# EasyEDA schematic 1-Schematic_Krasnodar-48.json
TITLE: Краснодар-48; REV: 1.0; Date: 2020-10-12; Sheet: 1/1; Drawn By: Romych; Company: zx-pk.ru
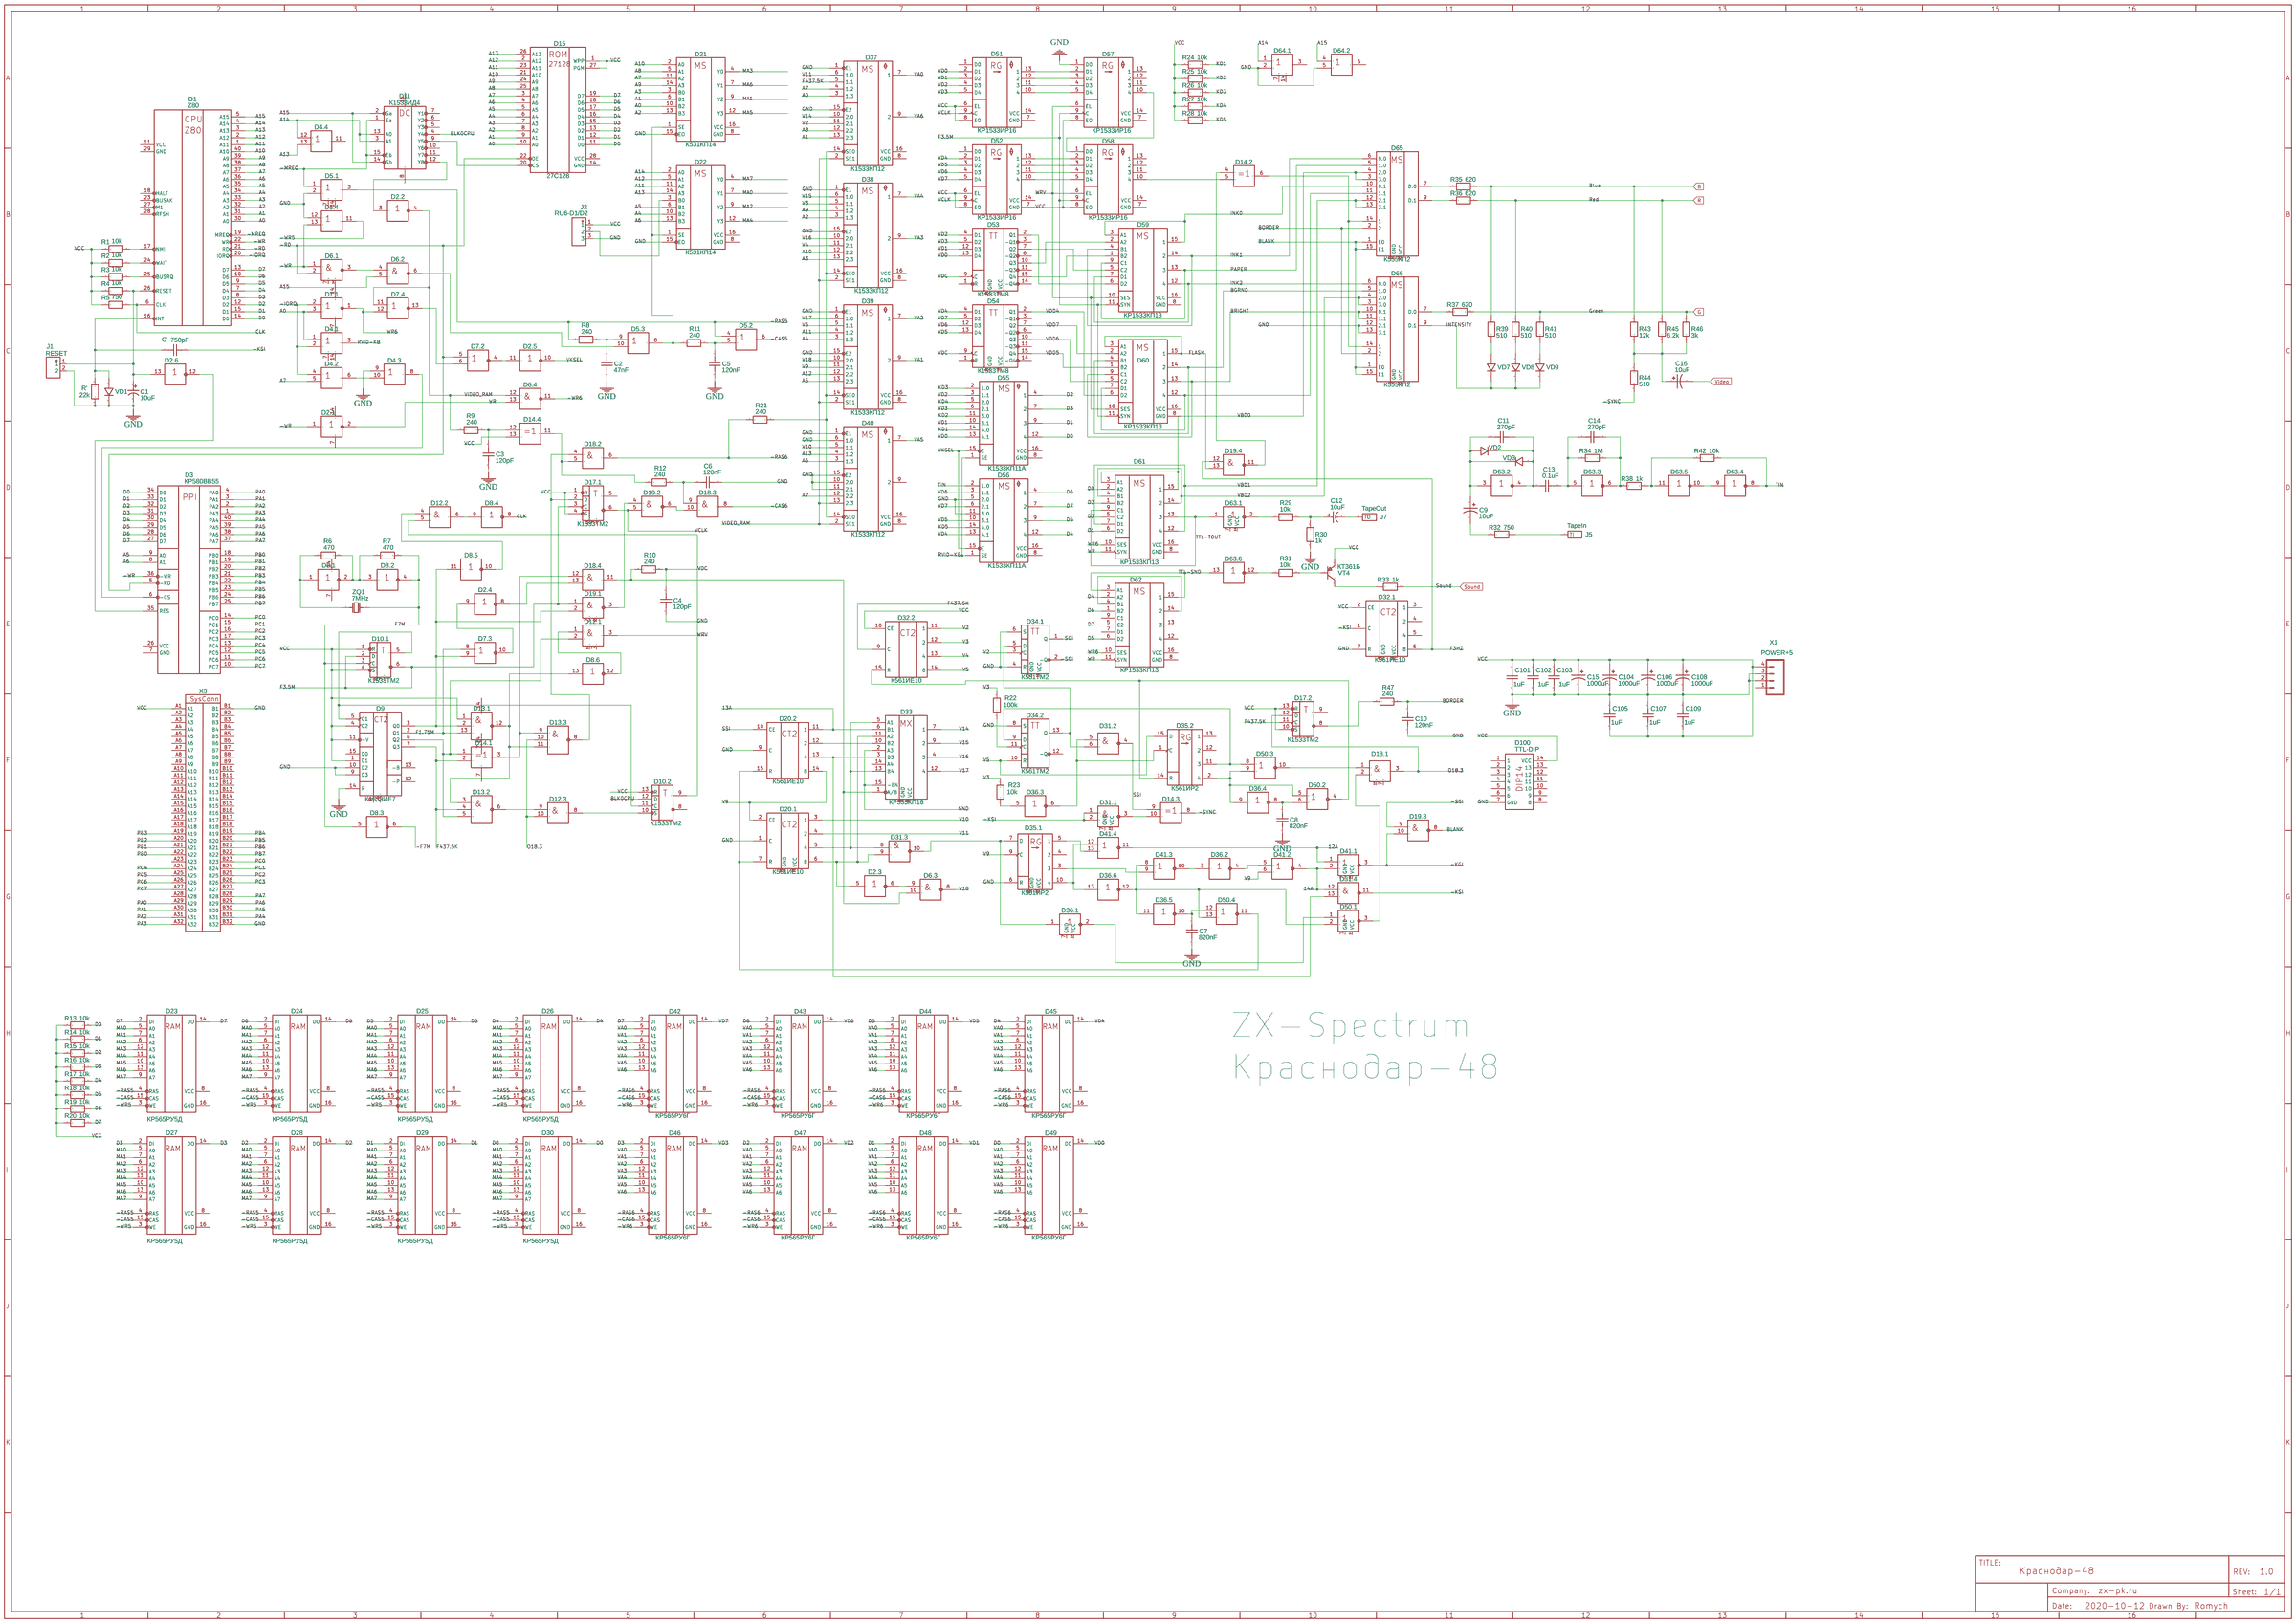
[diagram p0: schematic sheet]

## Parts
C1  10uF  [CAP-TH_BD6.3-P6.00-D0.8-FD]
C2  47nF  [CAP_TH_5.08]
C3  120pF  [CAP_TH_3.68]
C4  120pF  [CAP_TH_2.54]
C5  120nF  [CAP_TH_5.08]
C6  120nF  [CAP_TH_2.54]
C7  820nF  [CAP_TH_5.08]
C8  820nF  [CAP_TH_5.08]
C9  10uF  [CAP-TH_BD5.0-P2.00-D0.8-FD]
C10  120nF  [CAP_TH_5.08]
C11  270pF  [CAP_TH_2.54]
C12  10uF  [CAP-TH_BD5.0-P2.00-D0.8-FD]
C13  0.1uF  [CAP_TH_2.54]
C14  270pF  [CAP_TH_2.54]
C15  1000uF  [CAP-TH_BD6.3-P2.50-D1.0-FD]
C16  10uF  [CAP-TH_BD5.0-P2.00-D0.8-FD]
C101  1uF  [CAP_TH_10.16]
C102  1uF  [CAP_TH_10.16]
C103  1uF  [CAP_TH_3.68]
C104  1000uF  [CAP-TH_BD6.3-P2.50-D1.0-FD]
C105  1uF  [CAP_TH_5.08]
C106  1000uF  [CAP-TH_BD6.3-P2.50-D1.0-FD]
C107  1uF  [CAP_TH_5.08]
C108  1000uF  [CAP-TH_BD6.3-P2.50-D1.0-FD]
C109  1uF  [CAP_TH_5.08]
C'  750pF  [CAP-TH_L7.0-W3.0-P5.00-D0.9]
D1  Z80  [DIP-40_L50.8-W17.8-P2.54-LS15.2-BL]
D2  К1533ЛН1  [DIP-14_L20.0-W7.6-P2.54-LS8.0-BL]  (sections 1,2,3,4,5,6)
D3  КР580ВВ55  [DIP-40_L50.8-W17.8-P2.54-LS15.2-BL]
D4  К1533ЛЛ1  [DIP-14_L20.0-W7.6-P2.54-LS8.0-BL]  (sections 1,2,3,4)
D5  К1533ЛЛ1  [DIP-14_L20.0-W7.6-P2.54-LS8.0-BL]  (sections 1,2,3,4)
D6  К1533ЛА3  [DIP-14_L20.0-W7.6-P2.54-LS8.0-BL]  (sections 1,2,3,4)
D7  К1533ЛЕ1  [DIP-14_L20.0-W7.6-P2.54-LS8.0-BL]  (sections 1,2,3,4)
D8  К1533ЛН1  [DIP-14_L20.0-W7.6-P2.54-LS8.0-BL]  (sections 1,2,3,4,5,6)
D9  К1533ИЕ7  [DIP-16_L19.8-W6.5-P2.54-LS7.6-BL]
D10  К1533ТМ2  [DIP-14_L20.0-W7.6-P2.54-LS8.0-BL]  (sections 1,2)
D11  К1533ИД4  [DIP-16_L20.4-W5.8-P2.54-LS7.6-BL]
D12  К1533ЛИ1  [DIP-14_L20.0-W7.6-P2.54-LS8.0-BL]  (sections 1,2,3)
D13  К1533ЛА4  [DIP-14_L20.0-W7.6-P2.54-LS8.0-BL]  (sections 1,2,3)
D14  К1533ЛП5  [DIP-14_L20.0-W7.6-P2.54-LS8.0-BL]  (sections 1,2,3,4)
D15  27C128  [DIP-28_L35.6-W17.8-P2.54-LS15.2-BL]
D17  К1533ТМ2  [DIP-14_L20.0-W7.6-P2.54-LS8.0-BL]  (sections 1,2)
D18  К1533ЛИ1  [DIP-14_L20.0-W7.6-P2.54-LS8.0-BL]  (sections 1,2,3,4)
D19  К1533ЛА3  [DIP-14_L20.0-W7.6-P2.54-LS8.0-BL]  (sections 1,2,3,4)
D20  К561ИЕ10  [DIP-16_L19.8-W6.5-P2.54-LS7.6-BL]  (sections 1,2)
D21  К531КП14  [DIP-16_L20.4-W5.8-P2.54-LS7.6-BL]
D22  К531КП14  [DIP-16_L20.4-W5.8-P2.54-LS7.6-BL]
D23  КР565РУ5Д  [DIP-16_L19.8-W6.5-P2.54-LS7.6-BL]
D24  КР565РУ5Д  [DIP-16_L19.8-W6.5-P2.54-LS7.6-BL]
D25  КР565РУ5Д  [DIP-16_L19.8-W6.5-P2.54-LS7.6-BL]
D26  КР565РУ5Д  [DIP-16_L19.8-W6.5-P2.54-LS7.6-BL]
D27  КР565РУ5Д  [DIP-16_L19.8-W6.5-P2.54-LS7.6-BL]
D28  КР565РУ5Д  [DIP-16_L19.8-W6.5-P2.54-LS7.6-BL]
D29  КР565РУ5Д  [DIP-16_L19.8-W6.5-P2.54-LS7.6-BL]
D30  КР565РУ5Д  [DIP-16_L19.8-W6.5-P2.54-LS7.6-BL]
D31  К561ЛА7  [DIP-14_L20.0-W7.6-P2.54-LS8.0-BL]  (sections 1,2,3,4)
D32  К561ИЕ10  [DIP-16_L19.8-W6.5-P2.54-LS7.6-BL]  (sections 1,2)
D33  КР555КП16  [DIP-16_L19.8-W6.5-P2.54-LS7.6-BL]
D34  К561ТМ2  [DIP-14_L20.0-W7.6-P2.54-LS8.0-BL]  (sections 1,2)
D35  К561ИР2  [DIP-16_L19.8-W6.5-P2.54-LS7.6-BL]  (sections 1,2)
D36  К561ЛН2  [DIP-14_L20.0-W7.6-P2.54-LS8.0-BL]  (sections 1,2,3,4,5,6)
D37  К1533КП12  [DIP-16_L19.8-W6.5-P2.54-LS7.6-BL]
D38  К1533КП12  [DIP-16_L19.8-W6.5-P2.54-LS7.6-BL]
D39  К1533КП12  [DIP-16_L19.8-W6.5-P2.54-LS7.6-BL]
D40  К1533КП12  [DIP-16_L19.8-W6.5-P2.54-LS7.6-BL]
D41  К561ЛЕ5  [DIP-14_L20.0-W7.6-P2.54-LS8.0-BL]  (sections 1,2,3,4)
D42  КР565РУ6Г  [DIP-16_L19.8-W6.5-P2.54-LS7.6-BL]
D43  КР565РУ6Г  [DIP-16_L19.8-W6.5-P2.54-LS7.6-BL]
D44  КР565РУ6Г  [DIP-16_L19.8-W6.5-P2.54-LS7.6-BL]
D45  КР565РУ6Г  [DIP-16_L19.8-W6.5-P2.54-LS7.6-BL]
D46  КР565РУ6Г  [DIP-16_L19.8-W6.5-P2.54-LS7.6-BL]
D47  КР565РУ6Г  [DIP-16_L19.8-W6.5-P2.54-LS7.6-BL]
D48  КР565РУ6Г  [DIP-16_L19.8-W6.5-P2.54-LS7.6-BL]
D49  КР565РУ6Г  [DIP-16_L19.8-W6.5-P2.54-LS7.6-BL]
D50  К561ЛЕ5  [DIP-14_L20.0-W7.6-P2.54-LS8.0-BL]  (sections 1,2,3,4)
D51  КР1533ИР16  [DIP-14_L20.0-W7.6-P2.54-LS8.0-BL]
D52  КР1533ИР16  [DIP-14_L20.0-W7.6-P2.54-LS8.0-BL]
D53  К1533ТМ8  [DIP-16_L19.8-W6.5-P2.54-LS7.6-BL]
D54  К1533ТМ8  [DIP-16_L19.8-W6.5-P2.54-LS7.6-BL]
D55  К1533КП11A  [DIP-16_L19.8-W6.5-P2.54-LS7.6-BL]
D56  К1533КП11A  [DIP-16_L19.8-W6.5-P2.54-LS7.6-BL]
D57  КР1533ИР16  [DIP-14_L20.0-W7.6-P2.54-LS8.0-BL]
D58  КР1533ИР16  [DIP-14_L20.0-W7.6-P2.54-LS8.0-BL]
D59  КР1533КП13  [DIP-16_L19.8-W6.5-P2.54-LS7.6-BL]
D60  КР1533КП13  [DIP-16_L19.8-W6.5-P2.54-LS7.6-BL]
D61  КР1533КП13  [DIP-16_L19.8-W6.5-P2.54-LS7.6-BL]
D62  КР1533КП13  [DIP-16_L19.8-W6.5-P2.54-LS7.6-BL]
D63  К561ЛН2  [DIP-14_L20.0-W7.6-P2.54-LS8.0-BL]  (sections 1,2,3,4,5,6)
D64  К1533ЛЛ1  [DIP-14_L20.0-W7.6-P2.54-LS8.0-BL]  (sections 1,2)
D65  К555КП2  [DIP-16_L19.8-W6.5-P2.54-LS7.6-BL]
D66  К555КП2  [DIP-16_L19.8-W6.5-P2.54-LS7.6-BL]
D100  TTL-DIP  [DIP-14_L20.0-W7.6-P2.54-LS8.0-BL]
J1  RESET  [HDR-TH_2P-P2.54-V-M]
J2  RU6-D1/D2  [HDR-TH_3P-P2.54-V-M]
J5  TapeIn  [HDR-M-2.54_1X1]
J7  TapeOut  [HDR-M-2.54_1X1]
R1  10k  [R_0.125_7.62]
R2  10k  [R_0.125_7.62]
R3  10k  [R_0.125_7.62]
R4  10k  [R_0.125_7.62]
R5  750  [R_0.125_7.62]
R6  470  [R_0.125_5.08]
R7  470  [R_0.125_5.08]
R8  240  [R_0.125_5.08]
R9  240  [R_0.125_5.08]
R10  240  [R_0.125_V_TH]
R11  240  [R_0.125_5.08]
R12  240  [R_0.125_5.08]
R13  10k  [R_0.125_V_TH]
R14  10k  [R_0.125_V_TH]
R15  10k  [R_0.125_V_TH]
R16  10k  [R_0.125_V_TH]
R17  10k  [R_0.125_V_TH]
R18  10k  [R_0.125_V_TH]
R19  10k  [R_0.125_V_TH]
R20  10k  [R_0.125_V_TH]
R21  240  [R_0.125_V_TH]
R22  100k  [R_0.125_5.08]
R23  10k  [R_0.125_5.08]
R24  10k  [R_0.125_V_TH]
R25  10k  [R_0.125_V_TH]
R26  10k  [R_0.125_V_TH]
R27  10k  [R_0.125_V_TH]
R28  10k  [R_0.125_V_TH]
R29  10k  [R_0.125_V_TH]
R30  1k  [R_0.125_V_TH]
R31  10k  [R_0.125_V_TH]
R32  750  [R_0.125_V_TH]
R33  1k  [R_0.125_V_TH]
R34  1M  [R_0.125_V_TH]
R35  620  [R_0.125_V_TH]
R36  620  [R_0.125_V_TH]
R37  620  [R_0.125_V_TH]
R38  1k  [R_0.125_V_TH]
R39  510  [R_0.125_V_TH]
R40  510  [R_0.125_V_TH]
R41  510  [R_0.125_V_TH]
R42  10k  [R_0.125_V_TH]
R43  12k  [R_0.125_V_TH]
R44  510  [R_0.125_V_TH]
R45  6.2k  [R_0.125_V_TH]
R46  3k  [R_0.125_V_TH]
R47  240  [R_0.125_5.08]
R'  22k  [R_0.125_7.62]
VD1  1N4148  [D_TH_5.08]
VD2  1N4148  [D_TH_2.54_V]
VD3  1N4148  [D_TH_2.54_V]
VD7  1N4148  [D_TH_2.54_V]
VD8  1N4148  [D_TH_2.54_V]
VD9  1N4148  [D_TH_2.54_V]
VT4  КТ361Б  [TO-92-3_L4.8-W3.7-P2.54-L]
X1  POWER+5  [MOLEX-1X4]
X3  SysExt  [SYS_CONN_32X2_5.08]
ZQ1  7MHz  [OSC-49U-1]

## Library data of the parts
C1 C12 = ECLJ0612220M101P00: Supplier: LCSC; Supplier Part: C156809; Manufacturer: Guangdong TOPAZ Elec Tech; Contributor: LCSC
C2-C8 C10 C11 C13 C14 C101-C103 C105 C107 C109 C' = CK45-R3AD152K-VRY: Supplier: LCSC; Supplier Part: C340608; Manufacturer: TDK; Contributor: LCSC
C9 C16 = 25MH710MEFCT55X7: Supplier: LCSC; Supplier Part: C473156; Manufacturer: Rubycon; Contributor: LCSC
C15 C104 C106 C108 = SHW1000UF6.3V6.3X11: Supplier: LCSC; Supplier Part: C494544; Manufacturer: KNSCHA; Contributor: LCSC
D1 = Z80: Supplier: chipdip; Contributor: Roman Boykov
D2 D8 = К1533ЛН1: Supplier: chipdip; Contributor: Roman Boykov; subpart_no: 7
D3 = КР580ВВ55: Supplier: chipdip; Contributor: romychs_4693
D4 D5 D64 = К1533ЛЛ1: Supplier: chipdip; Contributor: Roman Boykov; subpart_no: 1
D6 D19 = К1533ЛА3: Supplier: chipdip; Contributor: Roman Boykov; subpart_no: 1
D7 = К1533ЛЕ1: Supplier: chipdip; Contributor: Roman Boykov; subpart_no: 1
D9 = К1533ИЕ7: Contributor: romychs_4693
D10 D17 = К1533ТМ2: Supplier: chipdip; Contributor: romychs_4693; subpart_no: 3
D11 = К1533ИД4: Supplier: chipdip; Contributor: romychs_4693
D12 D18 = К1533ЛИ1: Supplier: chipdip; Contributor: Roman Boykov; subpart_no: 1
D13 = К1533ЛА4: Supplier: chipdip; Contributor: Roman Boykov; subpart_no: 1
D14 = К1533ЛП5: Supplier: chipdip; Contributor: Roman Boykov; subpart_no: 4
D15 = 27C128: Supplier: chipdip; Contributor: romychs_4693
D20 D32 = К561ИЕ10: Supplier: chipdip; Contributor: romychs_4693; subpart_no: 2
D21 D22 = К531КП14: Supplier: chipdip; Contributor: romychs_4693
D23-D30 = КР565РУ5Г: Supplier: chipdip; Contributor: romychs_4693
D31 = К561ЛА7: Supplier: chipdip; Contributor: romychs_4693; subpart_no: 3
D33 = КР555КП16: Supplier: chipdip; Contributor: romychs_4693
D34 = К561ТМ2: Supplier: chipdip; Contributor: Roman Boykov; subpart_no: 1
D35 = К561ИР2: Supplier: chipdip; Contributor: Roman Boykov; subpart_no: 1
D36 D63 = К561ЛН2: Supplier: chipdip; Contributor: romychs_4693; subpart_no: 1
D37-D40 = К1533КП12: Supplier: chipdip; Contributor: romychs_4693
D41 D50 = К561ЛЕ5: Supplier: chipdip; Contributor: romychs_4693; subpart_no: 1
D42-D49 = КР565РУ6Г: Supplier: chipdip; Contributor: Roman Boykov
D51 D52 D57 D58 = КР1533ИР16: Supplier: chipdip; Contributor: romychs_4693
D53 D54 = К1533ТМ8: Supplier: chipdip; Contributor: Roman Boykov
D55 D56 = К1533КП11A: Supplier: chipdip; Contributor: Roman Boykov
D59-D62 = КР1533КП13: Supplier: chipdip; Contributor: romychs_4693
D65 D66 = К555КП2: Supplier: chipdip; Contributor: Roman Boykov
D100 = TTL-DIP: Contributor: romychs_4693
J1 = 22102021: Supplier: LCSC; Supplier Part: C587007; Manufacturer: MOLEX; Contributor: LCSC
J2 = A2541WV-3P_C609572: Supplier: LCSC; Supplier Part: C609572; Manufacturer: CJT(Changjiang Connectors); Manufacturer Part: A2541WV-3P; Contributor: LCSC
J5 J7 = HDR-M-2.54_1x1: Supplier Part: C81276; Supplier: LCSC; Contributor: LCEDA_Lib
R1-R47 R' = RN 1/8W 470R F T/B A1: Supplier: LCSC; Supplier Part: C433478; Manufacturer: TyoHM; Contributor: LCSC
VD1-VD3 VD7-VD9 = 1N4148: Contributor: EasyEDA
VT4 = 2SA1015-TA: Supplier: LCSC; Supplier Part: C160132; Manufacturer: Changjiang Electronics Tech (CJ); Contributor: LCSC
X1 = M04POLAR: Header 4; Contributor: SparkFun
X3 = SysConn-32x2: Supplier: chipdip; Contributor: romychs_4693
ZQ1 = X49UD12MSD2SC: Supplier: LCSC; Manufacturer: YXC; Supplier Part: C2188

## Nets
GND: C1.2 C2.2 C3.2 C4.2 C5.2 C6.2 C7.1 C8.1 C10.2 C15.2 C101.2 C102.2 C103.2 C104.2 C105.1 C106.2 C107.1 C108.2 C109.1 D4.9(1) D5.2 D5.12(1) D9.9(D3) D9.10(D2) D9.14(R) D20.1(C) D20.9(C) D21.15(EO) D22.15(EO) D32.7(R) D33.2(A3) D33.15(-EN) D34.4(R) D34.6(S) D34.8(S) D35.6(R) D37.1(E1) D37.15(E2) D38.1(E1) D38.15(E2) D39.1(E1) D39.15(E2) D40.1(E1) D40.6(1.0) D40.10(2.0) D40.11(2.1) D40.15(E2) D56.5(2.0) D56.11(3.0) D57.1(D0) D64.2 D64.5(2) D66.12(2.1) D66.13(3.1) D100.7(GND) J1.2 J2.3 R30.2 R'.2 VD1.2(K) X1.2 X1.3 X3.B1 X3.B32
V2: D32.11(1) D34.3(C) D37.11(2.1)
V3: D32.12(2) D38.5(1.1) R22.2 R23.2
V4: D32.13(4) D38.11(2.1)
V5: D32.14(8) D34.10(R) D35.15(D) D39.5(1.1)
V9: D20.2(CE) D20.14(8) D35.9(C) D39.11(2.1) D41.6(I2)
V10: D20.3(1) D40.5(1.1)
V11: D20.4(2) D37.6(1.0)
V14: D33.7(1) D37.10(2.0)
V15: D33.9(2) D38.6(1.0)
V16: D33.4(3) D38.10(2.0)
V17: D33.12(4) D39.6(1.0)
V18: D6.8(3) D39.10(2.0)
VCC: C15.1 C101.1 C102.1 C103.1 C104.1 C105.2 C106.1 C107.2 C108.1 C109.2 D9.1(D1) D9.4(C2) D9.11(-V) D10.1(R) D10.4(S) D10.13(R) D13.1(I1) D14.13(2) D15.1(WPP) D15.27(PGM) D17.1(R) D17.4(S) D17.10(S) D17.13(R) D32.2(CE) D32.10(CE) D51.6(EL) D51.8(EO) D52.6(EL) D52.7(GND) D52.8(EO) D57.8(EO) D58.8(EO) D100.14(VCC) J2.1 R1.1 R2.1 R3.1 R4.1 R5.1 R13.2 R14.2 R15.2 R16.2 R17.2 R18.2 R19.2 R20.2 R24.2 R25.2 R26.2 R27.2 R28.2 VT4.1(E) X1.4 X3.A1
VDD4: D54.2(Q1) D60.6(D2)
VDD5: D54.15(Q4) D60.1(B2)
VDD6: D54.10(Q3) D60.5(C2)
VDD7: D54.7(Q2) D60.2(A2)
12A: D41.1(I1) D41.11(O)
13A: D20.11(1) D33.6(B1)
14A: D31.12(I1) D41.2(I2) D41.4(O)
-CAS5: D5.6(3) D23.15(CAS) D24.15(CAS) D25.15(CAS) D26.15(CAS) D27.15(CAS) D28.15(CAS) D29.15(CAS) D30.15(CAS)
-CAS6: D18.8(3) D42.15(CAS) D43.15(CAS) D44.15(CAS) D45.15(CAS) D46.15(CAS) D47.15(CAS) D48.15(CAS) D49.15(CAS)
-F7M: D8.6(2)
-IORQ: D1.20(IORQ) D4.2 D4.4(1) D7.2(1)
-KGI: D19.10(2) D41.3(O)
-KSI: C'.1 D31.1(I1) D31.2(I2) D31.11(O) D32.1(C)
-MREQ: D1.19(MREQ) D5.1 D11.1(Ea) D11.15(Eb)
-RAS5: D5.3 D5.4(1) D23.4(RAS) D24.4(RAS) D25.4(RAS) D26.4(RAS) D27.4(RAS) D28.4(RAS) D29.4(RAS) D30.4(RAS) R8.1
-RAS6: D18.6(3) D42.4(RAS) D43.4(RAS) D44.4(RAS) D45.4(RAS) D46.4(RAS) D47.4(RAS) D48.4(RAS) D49.4(RAS) R21.1
-RD: D1.21(RD) D3.5(-RD) D6.2 D7.5(1) D15.22(DE)
-SGI: D19.9(1) D34.2(-Q)
-SYNC: D14.8(3) R44.2
-WR: D1.22(WR) D2.1 D3.36(-WR) D5.13(2) D6.1
-WR5: D5.11(3) D23.3(WE) D24.3(WE) D25.3(WE) D26.3(WE) D27.3(WE) D28.3(WE) D29.3(WE) D30.3(WE)
-WR6: D6.11(3) D42.3(WE) D43.3(WE) D44.3(WE) D45.3(WE) D46.3(WE) D47.3(WE) D48.3(WE) D49.3(WE)
A0: D1.30(A0) D4.1 D7.3(2) D15.10(A0) D21.10(B2) D37.3(1.3)
A1: D1.31(A1) D15.9(A1) D21.6(B1) D37.13(2.3)
A2: D1.32(A2) D15.8(A2) D21.13(B3) D38.3(1.3)
A3: D1.33(A3) D15.7(A3) D21.3(B0) D38.13(2.3)
A4: D1.34(A4) D15.6(A4) D22.10(B2) D39.3(1.3)
A5: D1.35(A5) D3.9(A0) D15.5(A5) D22.6(B1) D39.13(2.3)
A6: D1.36(A6) D3.8(A1) D15.4(A6) D22.13(B3) D40.3(1.3)
A7: D1.37(A7) D4.5(2) D15.3(A7) D21.11(A2) D37.4(1.2) D40.12(2.2)
A8: D1.38(A8) D15.25(A8) D21.5(A1) D37.12(2.2)
A9: D1.39(A9) D15.24(A9) D21.14(A3) D38.4(1.2)
A10: D1.40(A10) D15.21(A10) D21.2(A0) D38.12(2.2)
A11: D1.1(A11) D15.23(A11) D22.11(A2) D39.4(1.2)
A12: D1.2(A12) D15.2(A12) D22.5(A1) D39.12(2.2)
A13: D1.3(A13) D4.13(2) D15.26(A13) D22.14(A3) D40.4(1.2)
A14: D1.4(A14) D4.12(1) D11.3(A1) D11.13(A0) D22.2(A0) D64.1
A15: D1.5(A15) D6.5(2) D11.2(Sa) D11.14(Sb) D64.4(1)
B: R35.1 R39.1 R43.1
BGRND: D60.4(B1) D60.14(2) D66.5(1.0)
BLANK: D19.8(3) D65.1(E0) D65.15(E1) D66.1(E0) D66.15(E1)
BLK0CPU: D10.12(D) D11.4(Y4)
BORDER: C10.1 D65.2 D66.2 R47.2
BRIGHT: D60.9(C1) D60.13(3) D66.10(0.1) D66.11(1.1)
CLK: D1.6(CLK) D8.8(2) R5.2
D0: D1.14(D0) D3.34(D0) D15.11(D0) D30.2(DI) D30.14(DO) D49.2(DI) D55.12(4) D61.2(A2) R13.1
D1: D1.15(D1) D3.33(D1) D15.12(D1) D29.2(DI) D29.14(DO) D48.2(DI) D55.9(3) D61.6(D2) R14.1
D2: D1.12(D2) D3.32(D2) D15.13(D2) D28.2(DI) D28.14(DO) D47.2(DI) D55.4(1) D61.1(B2) R15.1
D3: D1.8(D3) D3.31(D3) D15.15(D3) D27.2(DI) D27.14(DO) D46.2(DI) D55.7(2) D61.5(C2) R16.1
D4: D1.7(D4) D3.30(D4) D15.16(D4) D26.2(DI) D26.14(DO) D45.2(DI) D56.12(4) D62.2(A2) R17.1
D5: D1.9(D5) D3.29(D5) D15.17(D5) D25.2(DI) D25.14(DO) D44.2(DI) D56.9(3) D62.6(D2) R18.1
D6: D1.10(D6) D3.28(D6) D15.18(D6) D24.2(DI) D24.14(DO) D43.2(DI) D56.4(1) D62.1(B2) R19.1
D7: D1.13(D7) D3.27(D7) D15.19(D7) D23.2(DI) D23.14(DO) D42.2(DI) D56.7(2) D62.5(C2) R20.1
F1.75M: D7.8(1) D9.2(Q1) D13.13(I3)
F3.5M: D10.2(D) D10.6(&#126;Q) D17.3(С) D19.1 D57.9(C) D58.9(C) D59.11(SYN) D60.11(SYN)
F3HZ: D19.12(1) D32.6(8)
F7M: D8.4(2) D8.5(1) D10.3(С) R7.2 ZQ1.1(OSC1)
F437.5K: D9.7(Q3) D13.4(I2) D14.2 D17.11(C) D32.9(C) D37.5(1.1)
FLASH: D19.13(2) D60.3(A1) D60.15(1)
G: R37.1 R41.1 R46.1
INK0: D59.3(A1) D59.15(1) D65.10(0.1)
INK1: D59.4(B1) D59.14(2) D65.6(0.0)
INK2: D59.7(D1) D59.12(4) D66.6(0.0)
INTENSITY: D66.9(D.1) VD7.2(K) VD8.2(K) VD9.2(K)
KD1: D55.14(4.0) R24.1
KD2: D55.11(3.0) R25.1
KD3: D55.2(1.0) R26.1
KD4: D55.5(2.0) R27.1
KD5: D56.14(4.0) R28.1
MA0: D22.7(Y1) D23.5(A0) D24.5(A0) D25.5(A0) D26.5(A0) D27.5(A0) D28.5(A0) D29.5(A0) D30.5(A0)
MA1: D21.9(Y2) D23.7(A1) D24.7(A1) D25.7(A1) D26.7(A1) D27.7(A1) D28.7(A1) D29.7(A1) D30.7(A1)
MA2: D22.9(Y2) D23.6(A2) D24.6(A2) D25.6(A2) D26.6(A2) D27.6(A2) D28.6(A2) D29.6(A2) D30.6(A2)
MA3: D21.4(Y0) D23.12(A3) D24.12(A3) D25.12(A3) D26.12(A3) D27.12(A3) D28.12(A3) D29.12(A3) D30.12(A3)
MA4: D22.12(Y3) D23.11(A4) D24.11(A4) D25.11(A4) D26.11(A4) D27.11(A4) D28.11(A4) D29.11(A4) D30.11(A4)
MA5: D21.12(Y3) D23.10(A5) D24.10(A5) D25.10(A5) D26.10(A5) D27.10(A5) D28.10(A5) D29.10(A5) D30.10(A5)
MA6: D21.7(Y1) D23.13(A6) D24.13(A6) D25.13(A6) D26.13(A6) D27.13(A6) D28.13(A6) D29.13(A6) D30.13(A6)
MA7: D22.4(Y0) D23.9(A7) D24.9(A7) D25.9(A7) D26.9(A7) D27.9(A7) D28.9(A7) D29.9(A7) D30.9(A7)
O18.3: D12.10(2) D13.10(I2) D17.12(D) D18.3
PA0: D3.4(PA0) X3.A29
PA1: D3.3(PA1) X3.A30
PA2: D3.2(PA2) X3.A31
PA3: D3.1(PA3) X3.A32
PA4: D3.40(PA4) X3.B31
PA5: D3.39(PA5) X3.B30
PA6: D3.38(PA6) X3.B29
PA7: D3.37(PA7) X3.B28
PAPER: D59.9(C1) D59.13(3) D65.5(1.0)
PB0: D3.18(PB0) X3.A22
PB1: D3.19(PB1) X3.A21
PB2: D3.20(PB2) X3.A20
PB3: D3.21(PB3) X3.A19
PB4: D3.22(PB4) X3.B19
PB5: D3.23(PB5) X3.B20
PB6: D3.24(PB6) X3.B21
PB7: D3.25(PB7) X3.B22
PC0: D3.14(PC0) X3.B23
PC1: D3.15(PC1) X3.B24
PC2: D3.16(PC2) X3.B25
PC3: D3.17(PC3) X3.B26
PC4: D3.13(PC4) X3.A24
PC5: D3.12(PC5) X3.A25
PC6: D3.11(PC6) X3.A26
PC7: D3.10(PC7) X3.A27
R: R36.1 R40.1 R45.1
RVID-KB: D4.3 D55.1(SE) D56.1(SE)
SGI: D34.1(Q)
Sound: R33.1
SSI: D14.9(1) D20.10(CE) D31.4(O)
TIN: D56.2(1.0) D63.8(O) R42.1
TTL-SND: D62.3(A1) D62.15(1) D63.13(I)
TTL-TOUT: D61.9(C1) D61.13(3) D63.1(I)
VA0: D37.7(1) D42.5(A0) D43.5(A0) D44.5(A0) D45.5(A0) D46.5(A0) D47.5(A0) D48.5(A0) D49.5(A0)
VA1: D39.9(2) D42.7(A1) D43.7(A1) D44.7(A1) D45.7(A1) D46.7(A1) D47.7(A1) D48.7(A1) D49.7(A1)
VA2: D39.7(1) D42.6(A2) D43.6(A2) D44.6(A2) D45.6(A2) D46.6(A2) D47.6(A2) D48.6(A2) D49.6(A2)
VA3: D38.9(2) D42.12(A3) D43.12(A3) D44.12(A3) D45.12(A3) D46.12(A3) D47.12(A3) D48.12(A3) D49.12(A3)
VA4: D38.7(1) D42.11(A4) D43.11(A4) D44.11(A4) D45.11(A4) D46.11(A4) D47.11(A4) D48.11(A4) D49.11(A4)
VA5: D40.7(1) D42.10(A5) D43.10(A5) D44.10(A5) D45.10(A5) D46.10(A5) D47.10(A5) D48.10(A5) D49.10(A5)
VA6: D37.9(2) D42.13(A6) D43.13(A6) D44.13(A6) D45.13(A6) D46.13(A6) D47.13(A6) D48.13(A6) D49.13(A6)
VBD0: D61.3(A1) D61.15(1) D65.3(3.0) D65.4(2.0)
VBD1: D61.7(D1) D61.12(4) D65.12(2.1) D65.13(3.1)
VBD2: D61.4(B1) D61.14(2) D66.3(3.0) D66.4(2.0)
VCLK: D17.6(&#126;Q) D19.5(2) D51.9(C) D52.9(C)
VD0: D49.14(DO) D51.2(D1) D53.13(D4) D55.13(4.1)
VD1: D48.14(DO) D51.3(D2) D53.12(D3) D55.10(3.1)
VD2: D47.14(DO) D51.4(D3) D53.4(D1) D55.3(1.1)
VD3: D46.14(DO) D51.5(D4) D53.5(D2) D55.6(2.1)
VD4: D45.14(DO) D52.2(D1) D54.4(D1) D56.13(4.1)
VD5: D44.14(DO) D52.3(D2) D54.13(D4) D56.10(3.1)
VD6: D43.14(DO) D52.4(D3) D54.12(D3) D56.3(1.1)
VD7: D42.14(DO) D52.5(D4) D54.5(D2) D56.6(2.1)
VDC: C4.1 D53.9(C) D54.9(C) R10.2
Video: C16.2
VIDEO_RAM: D2.4(2) D6.12(1) D7.11(1) D37.2(SE1) D38.2(SE1) D39.2(SE1) D40.2(SE1) D40.13(2.3) R9.1
VKSEL: D2.10(2) D55.15(E) D56.15(E)
WR: D2.2 D6.13(2) D61.11(SYN) D62.11(SYN)
WR6: D7.1(3) D7.12(2) D61.10(SES) D62.10(SES)
WRV: D12.3 D57.6(EL) D58.6(EL) D59.10(SES) D60.10(SES)
Net-(C1-1): C1.1 D1.26(RESET) D2.13(1) J1.1 R4.2
Net-(C2-1): C2.1 D5.9(1) R8.2
Net-(C3-1): C3.1 D14.12(1) R9.2
Net-(C5-1): C5.1 D5.5(2) R11.2
Net-(C6-1): C6.1 D18.9(1) R12.2
Net-(C7-2): C7.2 D36.10(O) D50.12(I1)
Net-(C8-2): C8.2 D36.8(O) D50.6(I2)
Net-(C9-1): C9.1 C11.1 D63.3(I) VD2.1(A) VD3.2(K)
Net-(C9-2): C9.2 R32.2
Net-(C11-2): C11.2 C13.1 D63.4(O) VD2.2(K) VD3.1(A)
Net-(C12-1): C12.1 R29.2 R30.1
Net-(C12-2): C12.2 J7.1(TO)
Net-(C13-2): C13.2 C14.1 D63.5(I) R34.2
Net-(C14-2): C14.2 D63.6(O) R34.1 R38.2
Net-(C16-1): C16.1 R43.2 R44.1 R45.2 R46.2
Net-(C'-2): C'.2 D1.16(INT) R'.1 VD1.1(A)
Net-(D1-17): D1.17(NMI) R1.2
Net-(D1-24): D1.24(WAIT) R2.2
Net-(D1-25): D1.25(BUSRQ) R3.2
Net-(D2.2-3): D2.3(1) D11.12(Y8)
Net-(D2.3-5): D2.5(1) D20.6(8) D31.9(I2) D33.11(A2)
Net-(D2.3-6): D2.6(2) D6.9(1)
Net-(D2.4-8): D2.8(2) D18.13(2)
Net-(D2.4-9): D2.9(1) D7.10(3)
Net-(D2.5-11): D2.11(1) D7.4(3)
Net-(D2.6-12): D2.12(2) D3.35(RES)
Net-(D3-6): D3.6(-CS) D4.8(3)
Net-(D4.2-6): D4.6(3) D4.10(2)
Net-(D5.3-8): D5.8(3) D21.1(SE) D22.1(SE) R11.1
Net-(D5.3-10): D5.10(2) D6.6(3)
Net-(D6.1-3): D6.3 D6.4(1)
Net-(D6.1-14): D6.14(VCC) D7.14(VCC)
Net-(D6.3-10): D6.10(2) D18.11(3) D33.1(A/B) R10.1
Net-(D7.2-6): D7.6(2) D7.13(3)
Net-(D7.3-9): D7.9(2) D8.11(1) D9.3(Q0) D13.2(I2) D19.2
Net-(D8.1-1): D8.1 R6.1 ZQ1.2(OSC2)
Net-(D8.1-2): D8.2 D8.3(1) R6.2 R7.1
Net-(D8.4-9): D8.9(1) D12.6(3)
Net-(D8.5-10): D8.10(2) D12.4(1)
Net-(D8.6-12): D8.12(2) D12.1
Net-(D8.6-13): D8.13(1) D13.3(I1) D13.11(I3) D13.12(O)
Net-(D9-5): D9.5(C1) D10.5(Q) D10.11(C)
Net-(D9-6): D9.6(Q2) D12.2 D13.5(I3) D14.1
Net-(D10.2-9): D10.9(Q) D12.5(2)
Net-(D10.2-10): D10.10(S) D12.8(3)
Net-(D11-9): D11.9(Y5) D15.20(CS)
Net-(D12.3-9): D12.9(1) D13.6(O)
Net-(D13.3-8): D13.8(O) D17.2(D) D18.4(1)
Net-(D13.3-9): D13.9(I1) D14.3 D18.12(1)
Net-(D14.2-4): D14.4(1) D19.11(3)
Net-(D14.2-5): D14.5(2) D58.10(4)
Net-(D14.2-6): D14.6(3) D65.14(1) D66.14(1)
Net-(D14.3-10): D14.10(2) D31.3(O)
Net-(D14.4-11): D14.11(3) D18.5(2) R12.1
Net-(D17.2-8): D17.8(-Q) R47.1
Net-(D18.1-1): D18.1 D50.10(O)
Net-(D18.1-2): D18.2 D50.3(O)
Net-(D18.3-10): D18.10(2) D19.6(3)
Net-(D19.1-3): D19.3 D19.4(1)
Net-(D20.1-5): D20.5(4) D31.8(I1) D33.5(A1) D33.13(B4)
Net-(D20.1-7): D20.7(R) D20.15(R) D50.11(O)
Net-(D20.2-12): D20.12(2) D33.10(B2)
Net-(D20.2-13): D20.13(4) D31.13(I2) D33.3(B3)
Net-(D22-3): D22.3(B0) J2.2
Net-(D31.2-5): D31.5(I1) D35.1(C) D36.6(O)
Net-(D31.2-6): D31.6(I2) D34.5(D) D34.13(Q)
Net-(D31.3-10): D31.10(O) D35.7(D) D36.1(I)
Net-(D32.2-15): D32.15(R) D35.14(R) D50.4(O)
Net-(D34.2-9): D34.9(D) D35.11(3) D50.8(I1)
Net-(D34.2-11): D34.11(C) R22.1
Net-(D35.1-3): D35.3 D41.9(I2)
Net-(D35.1-5): D35.5(1) D41.13(I2)
Net-(D35.1-10): D35.10(4) D36.13(I) D41.12(I1)
Net-(D35.2-2): D35.2(4) D36.9(I) D50.5(I1) D50.9(I2)
Net-(D36.1-2): D36.2(O) D50.1(I1)
Net-(D36.2-3): D36.3(I) D41.10(O)
Net-(D36.2-4): D36.4(O) D41.5(I1)
Net-(D36.3-5): D36.5(I) R23.1
Net-(D36.5-11): D36.11(I) D36.12(O) D41.8(I1) D50.2(I2) D50.13(I2)
Net-(D37-14): D37.14(SE0) D38.14(SE0) D39.14(SE0) D40.14(SE0) R21.2
Net-(D51-10): D51.10(4) D57.5(D4)
Net-(D51-11): D51.11(3) D57.4(D3)
Net-(D51-12): D51.12(2) D57.3(D2)
Net-(D51-13): D51.13(1) D57.2(D1)
Net-(D52-10): D52.10(4) D58.5(D4)
Net-(D52-11): D52.11(3) D58.4(D3)
Net-(D52-12): D52.12(2) D58.3(D2)
Net-(D52-13): D52.13(1) D58.2(D1)
Net-(D53-2): D53.2(Q1) D59.6(D2)
Net-(D53-7): D53.7(Q2) D59.5(C2)
Net-(D53-10): D53.10(Q3) D59.2(A2)
Net-(D53-15): D53.15(Q4) D59.1(B2)
Net-(D57-10): D57.10(4) D58.1(D0)
Net-(D60-7): D60.7(D1) D60.12(4) D65.11(1.1)
Net-(D62-4): D62.4(B1) D62.14(2)
Net-(D63.1-2): D63.2(O) R29.1
Net-(D63.4-9): D63.9(I) D63.10(O)
Net-(D63.5-11): D63.11(I) R38.1 R42.2
Net-(D63.6-12): D63.12(O) R31.1
Net-(D65-7): D65.7(D.0) R35.2
Net-(D65-9): D65.9(D.1) R36.2
Net-(D66-7): D66.7(D.0) R37.2
Net-(J5-1): J5.1(TI) R32.1
Net-(R31-2): R31.2 VT4.3(B)
Net-(R33-2): R33.2 VT4.2(C)
Net-(R39-2): R39.2 VD7.1(A)
Net-(R40-2): R40.2 VD8.1(A)
Net-(R41-2): R41.2 VD9.1(A)

Not connected (* = marked no-connect by the designer): D1 11(VCC) 18(HALT) 23(BUSAK) 27(M1) 28(RFSH) 29(GND); D2 7(GND) 14(VCC); D3 7(GND) 26(VCC); D4 7(GND) 11(3) 14(VCC); D5 7(GND) 14(VCC); D6 7(GND); D7 7(GND); D8 7(GND) 14(VCC); D9 8(GND) 12(-P) 13(-B) 15(D0) 16(VCC); D10 7(GND) 8(-Q) 14(VCC); D11 5(Y3) 6(Y2) 7(Y1) 8(GND) 10(Y6) 11(Y7) 16(VCC); D12 7(GND) 14(VCC); D13 7(GND) 14(VCC); D14 7(GND) 14(VCC); D15 14(GND) 28(VCC); D17 5(Q) 7(GND) 9(Q) 14(VCC); D18 7(GND) 14(VCC); D19 7(GND) 14(VCC); D20 8(GND) 16(VCC); D21 8(GND) 16(VCC); D22 8(GND) 16(VCC); D23 8(VCC) 16(GND); D24 8(VCC) 16(GND); D25 8(VCC) 16(GND); D26 8(VCC) 16(GND); D27 8(VCC) 16(GND); D28 8(VCC) 16(GND); D29 8(VCC) 16(GND); D30 8(VCC) 16(GND); D31 7(GND) 14(VCC); D32 3(1) 4(2) 5(4) 8(GND) 16(VCC); D33 8(GND) 14(A4) 16(VCC); D34 7(GND) 12(-Q) 14(VCC); D35 4(2) 8(GND) 12(2) 13(1) 16(VCC); D36 7(GND) 14(VCC); D37 8(GND) 16(VCC); D38 8(GND) 16(VCC); D39 8(GND) 16(VCC); D40 8(GND) 9(2) 16(VCC); D41 7(GND) 14(VCC); D42 8(VCC) 16(GND); D43 8(VCC) 16(GND); D44 8(VCC) 16(GND); D45 8(VCC) 16(GND); D46 8(VCC) 16(GND); D47 8(VCC) 16(GND); D48 8(VCC) 16(GND); D49 8(VCC) 16(GND); D50 7(GND) 14(VCC); D51 1(D0) 7(GND) 14(VCC); D52 1(D0) 14(VCC); D53 1(R) 3(-Q1) 6(-Q2) 8(GND) 11(-Q3) 14(-Q4) 16(VCC); D54 1(R) 3(-Q1) 6(-Q2) 8(GND) 11(-Q3) 14(-Q4) 16(VCC); D55 8(GND) 16(VCC); D56 8(GND) 16(VCC); D57 7(GND) 11(3) 12(2) 13(1) 14(VCC); D58 7(GND) 11(3) 12(2) 13(1) 14(VCC); D59 8(GND) 16(VCC); D60 8(GND) 16(VCC); D61 8(GND) 16(VCC); D62 7(D1) 8(GND) 9(C1) 12(4) 13(3) 16(VCC); D63 7(GND) 14(VCC); D64 3 6(3) 7(GND) 14(VCC); D65 8(GND) 16(VCC); D66 8(GND) 16(VCC); D100 1 2 3 4 5 6 8 9 10 11 12 13; X1 1; X3 A2 A3 A4 A5 A6 A7 A8 A9 A10 A11 A12 A13 A14 A15 A16 A17 A18 A23 A28 B2 B3 B4 B5 B6 B7 B8 B9 B10 B11 B12 B13 B14 B15 B16 B17 B18 B27

## Notes on the sheet
- ZX-Spectrum
- Краснодар-48
